# EAGLE schematic Schematic (EAGLE 9.5.2)
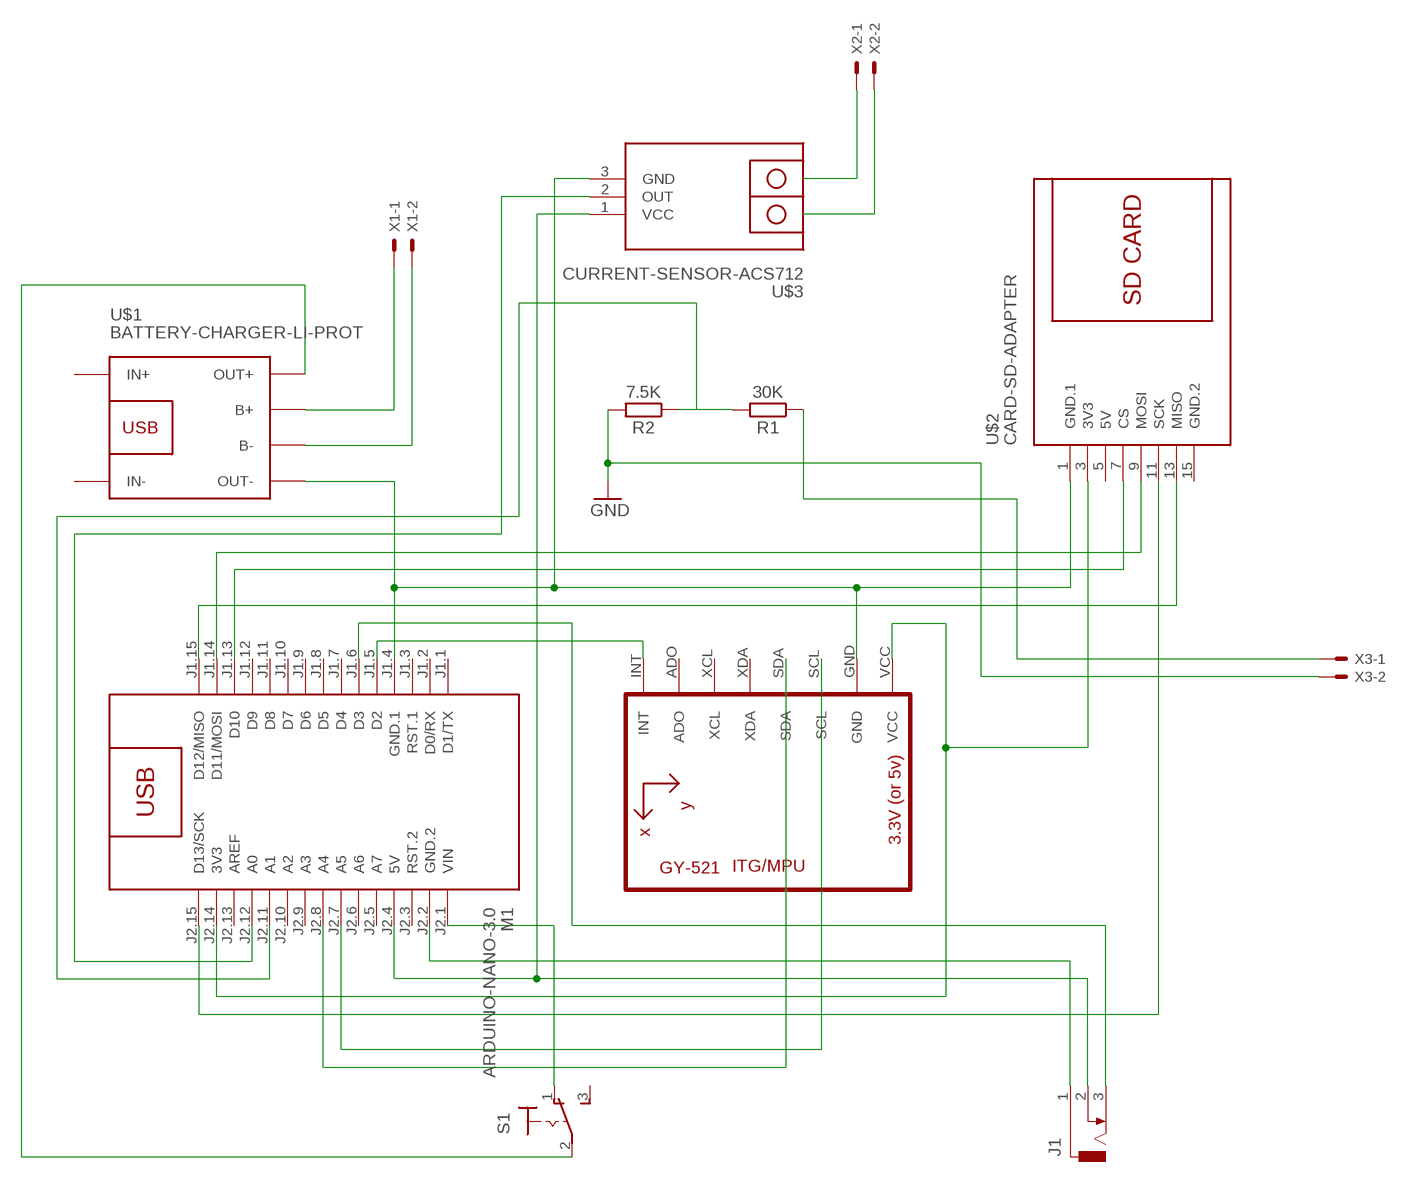
[diagram p0: schematic, sheet 1]

## Parts
J1  DCJ0303  [DCJ0303]
M1  ARDUINO-NANO-3.0  [ARDUINO-NANO-3.0]
R1  30K  R_AXIAL-7.2MM-PITCH  [RESAD724W46L381D178B]
R2  7.5K  R_AXIAL-7.2MM-PITCH  [RESAD724W46L381D178B]
S1  320-916  [320-916]
U1  GY-521MPU6050  [GY-521]
U$1  BATTERY-CHARGER-LI-PROT  [BATTERY-CHARGER-LI-PROT]
U$2  CARD-SD-ADAPTER  [CARD-SD-ADAPTER]
U$3  CURRENT-SENSOR-ACS712  [CURRENT-SENSOR-ACS712]
X1  22-23-2021  [22-23-2021]
X2  22-23-2021  [22-23-2021]
X3  22-23-2021  [22-23-2021]

## Nets
GND: R2.2 X3.2
N$1: U$1.B+ X1.1
N$2: U$1.B- X1.2
N$3: M1.J1.4(GND.1) U1.GND U$1.OUT- U$2.1(GND.1) U$3.3(GND)
N$4: S1.2(P) U$1.OUT+
N$5: M1.J2.1(VIN) S1.1(O)
N$6: M1.J2.14(3V3) U1.VCC U$2.3(3V3)
N$7: M1.J1.15(D12/MISO) U$2.13(MISO)
N$8: M1.J2.15(D13/SCK) U$2.11(SCK)
N$9: M1.J1.13(D10) U$2.7(CS)
N$10: M1.J1.14(D11/MOSI) U$2.9(MOSI)
N$11: J1.1 M1.J2.2(GND.2)
N$12: J1.2 M1.J2.4(5V) U$3.1(VCC)
N$13: J1.3 M1.J1.6(D3)
N$14: M1.J2.12(A0) U$3.2(OUT)
N$15: M1.J2.7(A5) U1.SCL
N$16: M1.J2.8(A4) U1.SDA
N$17: R1.1 X3.1
N$18: M1.J1.5(D2) U1.INT
N$19: X2.1
N$20: X2.2
S: M1.J2.11(A1) R1.2 R2.1
Unconnected: M1.J1.1(D1/TX) M1.J1.2(D0/RX) M1.J1.3(RST.1) M1.J1.7(D4) M1.J1.8(D5) M1.J1.9(D6) M1.J1.10(D7) M1.J1.11(D8) M1.J1.12(D9) M1.J2.3(RST.2) M1.J2.5(A7) M1.J2.6(A6) M1.J2.9(A3) M1.J2.10(A2) M1.J2.13(AREF) S1.3(S) U1.ADO U1.XCL U1.XDA U$1.IN+ U$1.IN-

## Power pins joined to a net without a drawn wire
5V: U$2.5(5V)
GND.2: U$2.15(GND.2)

## Library data of the parts
J1 = con-jack:DCJ0303: DC POWER JACK Source: DCJ0303.pdf; OC_FARNELL: unknown; OC_NEWARK: unknown
M1 = diy-modules:ARDUINO-NANO-3.0: Arduino Nano 3.0 and compatible devices More details available here: https://www.arduino.cc/en/Main/ArduinoBoardNano Click here to find device on ebay.com <http://www.ebay.com/sch/arduino+nano>
R1 R2 = Resistor:R: Resistor Fixed - Generic; CATEGORY: Resistor; SUB-CATEGORY: Fixed
S1 = switch:320-916: TOGGLE SWITCH distributor RS Components
U1 = gy-521:GY-521
U$1 = diy-modules:BATTERY-CHARGER-LI-PROT: Lithium Battery 5V Charger with protection circuit More details available here: http://www.instructables.com/id/DIY-Lithium-ion-Battery-Charger/step4/TP4056-based-lithium-ion-battery-charger-module/ Click here to find device on ebay.com <http://www.ebay.com/sch/tp4056+charger+usb+protection>
U$2 = diy-modules:CARD-SD-ADAPTER: Full Size SD Card Adapter Module with onboard 3.3V regulator Guide describing how to use SD card with Arduino is available here: https://www.arduino.cc/en/Reference/SDCardNotes Click here to find device on ebay.com <http://www.ebay.com/sch/sd+card+socket+module>
U$3 = diy-modules:CURRENT-SENSOR-ACS712: Isolated Bipolar Current Sensors based on ACS712 chip More details available here: http://embedded-lab.com/blog/a-brief-overview-of-allegro-acs712-current-sensor-part-1/ Click here to find device on ebay.com <http://www.ebay.com/sch/acs712+module> Note: There are many available versions with different pinout. Please check before use
X1-X3 = con-molex:22-23-2021: .100" (2.54mm) Center Header - 2 Pin; MF: MOLEX; MPN: 22-23-2021; OC_FARNELL: 1462926; OC_NEWARK: 25C3832